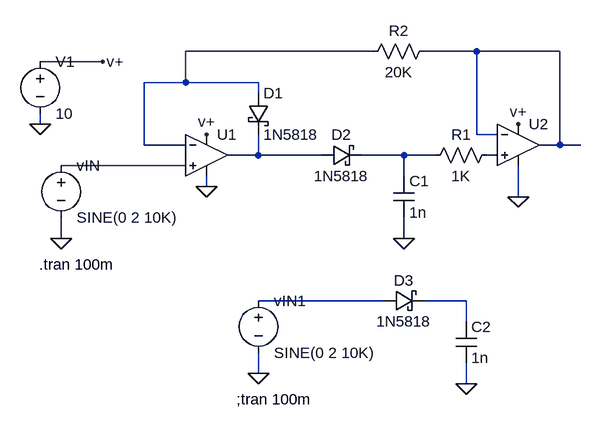
[diagram p0: schematic Peak Detector active and passive.asc]
Peak Detector active and passive.asc, the LTspice schematic file:
Version 4
SHEET 1 1240 680
WIRE 432 -48 144 -48
WIRE 592 -48 512 -48
WIRE 720 -48 592 -48
WIRE 16 -32 -80 -32
WIRE 144 0 144 -48
WIRE 144 0 80 0
WIRE 256 0 144 0
WIRE 256 16 256 0
WIRE -80 64 -80 48
WIRE 592 80 592 -48
WIRE 624 80 592 80
WIRE 80 96 80 0
WIRE 144 96 80 96
WIRE 720 96 720 -48
WIRE 720 96 688 96
WIRE 752 96 720 96
WIRE 256 112 256 80
WIRE 256 112 208 112
WIRE 352 112 256 112
WIRE 480 112 416 112
WIRE 528 112 480 112
WIRE 624 112 608 112
WIRE 144 128 -48 128
WIRE 480 144 480 112
WIRE 176 160 176 144
WIRE 656 176 656 128
WIRE -48 240 -48 208
WIRE 480 240 480 208
WIRE 448 336 256 336
WIRE 576 336 512 336
WIRE 576 368 576 336
WIRE 256 448 256 416
WIRE 576 464 576 432
FLAG -48 240 0
FLAG 176 160 0
FLAG -80 64 0
FLAG 16 -32 v+
FLAG 176 80 v+
FLAG 480 240 0
FLAG 656 176 0
FLAG 656 64 v+
FLAG 256 448 0
FLAG 576 464 0
SYMBOL voltage -48 112 R0
WINDOW 123 0 0 Left 0
WINDOW 39 0 0 Left 0
SYMATTR InstName vIN
SYMATTR Value SINE(0 2 10K)
SYMBOL voltage -80 -48 R0
SYMATTR InstName V1
SYMATTR Value 10
SYMBOL schottky 240 16 R0
SYMATTR InstName D1
SYMATTR Value 1N5818
SYMATTR Description Diode
SYMATTR Type diode
SYMBOL schottky 352 128 R270
WINDOW 0 32 32 VTop 2
WINDOW 3 0 32 VBottom 2
SYMATTR InstName D2
SYMATTR Value 1N5818
SYMATTR Description Diode
SYMATTR Type diode
SYMBOL cap 464 144 R0
SYMATTR InstName C1
SYMATTR Value 1n
SYMBOL res 624 96 R90
WINDOW 0 0 56 VBottom 2
WINDOW 3 32 56 VTop 2
SYMATTR InstName R1
SYMATTR Value 1K
SYMBOL res 528 -64 R90
WINDOW 0 0 56 VBottom 2
WINDOW 3 32 56 VTop 2
SYMATTR InstName R2
SYMATTR Value 20K
SYMBOL OpAmps\\UniversalOpamp2 176 112 R0
SYMATTR InstName U1
SYMBOL OpAmps\\UniversalOpamp2 656 96 R0
SYMATTR InstName U2
SYMBOL voltage 256 320 R0
WINDOW 123 0 0 Left 0
WINDOW 39 0 0 Left 0
SYMATTR InstName vIN1
SYMATTR Value SINE(0 2 10K)
SYMBOL schottky 448 352 R270
WINDOW 0 32 32 VTop 2
WINDOW 3 0 32 VBottom 2
SYMATTR InstName D3
SYMATTR Value 1N5818
SYMATTR Description Diode
SYMATTR Type diode
SYMBOL cap 560 368 R0
SYMATTR InstName C2
SYMATTR Value 1n
TEXT -82 280 Left 2 !.tran 100m
TEXT 222 488 Left 2 !;tran 100m

The netlist it stands for:
* Peak Detector active and passive.asc
vIN N006 0 SINE(0 2 10K)
V1 v+ 0 10
D1 N001 N003 1N5818
D2 N003 N004 1N5818
C1 N004 0 1n
R1 N005 N004 1K
R2 N002 N001 20K
XU1 N006 N001 v+ 0 N003 level.2 Avol=1Meg GBW=10Meg Slew=10Meg ilimit=25m rail=0 Vos=0 phimargin=45 en=0 enk=0 in=0 ink=0 Rin=500Meg  ; pins IN+ IN- V+ V- OUT
XU2 N005 N002 v+ 0 N002 level.2 Avol=1Meg GBW=10Meg Slew=10Meg ilimit=25m rail=0 Vos=0 phimargin=45 en=0 enk=0 in=0 ink=0 Rin=500Meg  ; pins IN+ IN- V+ V- OUT
vIN1 N007 0 SINE(0 2 10K)
D3 N007 N008 1N5818
C2 N008 0 1n
.model D D
.lib standard.dio
.tran 100m
;tran 100m
.lib UniversalOpamps2.sub
.backanno
.end